# Altium schematic sheet RS485.SchDoc
size A4
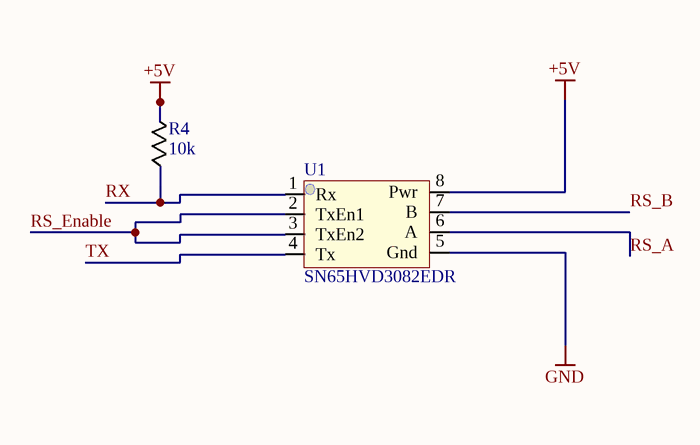
[diagram p0: RS485.SchDoc]

## Parts
R4  10k  [0402]
U1  SN65HVD3082EDR  [SOIC 8]

## Nets
+5V: R4.2 U1.8(Pwr)
GND: U1.5(Gnd)
RS_A: U1.6(A)
RS_B: U1.7(B)
RS_Enable: U1.2(TxEn1) U1.3(TxEn2)
RX: R4.1 U1.1(Rx)
TX: U1.4(Tx)

## Library data of the parts
R4 = Resistor 0805: RC0402FR-0710KL
U1 = MAX485